# Altium schematic sheet Module 4G.SchDoc
size A3; SheetNumber: 4; SheetTotal: 8
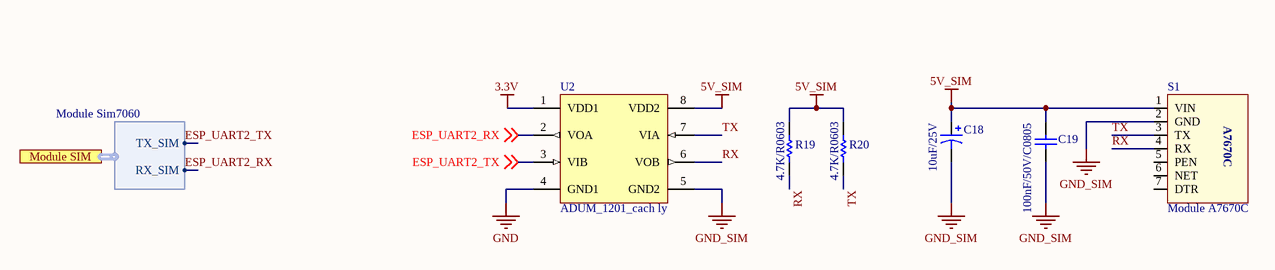
[diagram p0: Module 4G.SchDoc]

## Parts
C18  10uF/25V  [CAP TANT SIZE B]
C19  100nF/50V/C0805  [C0805]
R19  4.7K/R0603  [R0603]
R20  4.7K/R0603  [R0603]
S1  Module A7670C  [Module A7670C]
U2  ADUM_1201_cach ly  [ADUM1201]

## Ports
Module SIM (harness Module Sim7060)

## Harnesses
Module Sim7060: TX_SIM, RX_SIM

## Nets
3.3V: U2.1(VDD1)
5V_SIM: C18.1(+) C19.2 R19.2 R20.2 S1.1(VIN) U2.8(VDD2)
GND: U2.4(GND1)
GND_SIM: C18.2(-) C19.1 S1.2(GND) U2.5(GND2)
ESP_UART2_RX: U2.2(VOA) ; off-sheet ESP_UART2_RX, port Module SIM.RX_SIM
ESP_UART2_TX: U2.3(VIB) ; off-sheet ESP_UART2_TX, port Module SIM.TX_SIM
RX: R19.1 S1.4(RX) U2.6(VOB)
TX: R20.1 S1.3(TX) U2.7(VIA)

Not connected (* = marked no-connect by the designer): S1 5(PEN) 6(NET) 7(DTR)

## Notes on the sheet
- Title
- Size:
- Date:
- A3
- Number:
- Time:
- Revision:
- Sheet
- of
- NICHIETSUVN.COM <http://NICHIETSUVN.COM>
- R&D
- File:
- (in symbol Module A7670C) A7670C

## Library data of the parts
C18 = 10uF/25V/SIZE B/10%: CAP TANT 10UF 25V 10% 1411; Manufacturer: KEMET; Manufacturer Part Number: T491B106K025AT; Manufacturer Size Code: B; Capacitance: 10µF; Type: Molded; ESR (Equivalent Series Resistance): 3 Ohm; Lifetime @ Temp.: 2000 Hrs @ 85°C; Supplier 1: Digi-Key; RoHS: RoHS Compliant; Category: Capacitors; Stock 1: 74222; Pricing 1: 1=1.11, 10=0.842, 25=0.7448, 50=0.6994, 100=0.6022, 250=0.54392, 500=0.46622, 1000=0.40147 (USD); Packaging: Cut Tape (CT); Part Status: Active; Tolerance: ±10%; Voltage - Rated: 25V; Operating Temperature: -55°C ~ 125°C; Mounting Type: Surface Mount; Package / Case: 1411 (3528 Metric); Size / Dimension: 0.138" L x 0.110" W (3.50mm x 2.80mm); Height - Seated (Max): 0.083" (2.10mm); Lead Spacing: -; Features: General Purpose; Failure Rate: -; ComponentLink1URL: http://www.kemet.com/Lists/ProductCatalog/Attachments/254/KEM_T2005_T491.pdf; ComponentLink1Description: http://www.kemet.com/Lists/ProductCatalog/Attachments/254/KEM_T2005_T491.pdf; Supplier Part Number 1: 399-5125-1-ND
C19 = 0.1uF/50V/C0805/10%: CAP CER 0.1UF 50V 10% X7R 0805; Manufacturer: Samsung Electro-Mechanics America, Inc.; Manufacturer Part Number: CL21B104KBCNNNC; Capacitance: 0.1µF; RoHS: RoHS Compliant; Category: Capacitors; Packaging: Cut Tape (CT); Tolerance: ±10%; Voltage - Rated: 50V; Temperature Coefficient: X7R; Mounting Type: Surface Mount, MLCC; Operating Temperature: -55°C ~ 125°C; Applications: General Purpose; Ratings: -; Package / Case: 0805 (2012 Metric); Size / Dimension: 0.079" L x 0.049" W (2.00mm x 1.25mm); Height - Seated (Max): -; Thickness (Max): 0.037" (0.95mm); Lead Spacing: -; Features: -; Lead Style: -; ComponentLink1URL: http://www.samsungsem.com/kr/front/downloadcms.do?path=/kr/support/product-search/mlcc/__icsFiles/afieldfile/2015/04/16&fileName=CL21B104KBCNNNC.pdf; ComponentLink1Description: http://www.samsungsem.com/kr/front/downloadcms.do?path=/kr/support/product-search/mlcc/__icsFiles/afieldfile/2015/04/16&fileName=CL21B104KBCNNNC.pdf; Supplier 1: Digi-Key; Supplier Part Number 1: 1276-1003-1-ND
R19 R20 = 4.7K/R0603/1%: RES SMD 4.7K OHM 1% 1/10W 0603; Manufacturer: Yageo; Manufacturer Part Number: RC0603FR-074K7L; Power (Watts): 0.1W, 1/10W; Temperature Coefficient: ±100ppm/°C; Supplier 1: Digi-Key; RoHS: RoHS Compliant; Category: Resistors; Stock 1: 3295420; Pricing 1: 1=0.1, 10=0.014, 25=0.01, 100=0.0057, 250=0.00436, 500=0.00348, 1000=0.00257, 2500=0.00223 (USD); Packaging: Cut Tape (CT); Resistance (Ohms): 4.7k; Tolerance: ±1%; Composition: Thick Film; Features: Moisture Resistant; Operating Temperature: -55°C ~ 155°C; Package / Case: 0603 (1608 Metric); Supplier Device Package: 0603; Size / Dimension: 0.063" L x 0.031" W (1.60mm x 0.80mm); Height: 0.022" (0.55mm); Number of Terminations: 2; ComponentLink1URL: http://www.yageo.com/NewPortal/yageodocoutput?fileName=/pdf/R-Chip/PYu-RC_Group_51_RoHS_L_3.pdf; ComponentLink1Description: http://www.yageo.com/NewPortal/yageodocoutput?fileName=/pdf/R-Chip/PYu-RC_Group_51_RoHS_L_3.pdf; Supplier Part Number 1: 311-4.70KHRCT-ND; PN_LCSC: *; Link_LCSC: *; DNI: *
S1 = Module A7670C: ComponentLink1Description: Buy; ComponentLink1URL: https://linhkienthuduc.com/module-4g-simcom-a7670cas-da-ra-chan-thay-the-module-sim800l?fbclid=IwAR1G5wYYUv7p81VrcWdIp5blH95Ph3Cg0YzZirZTlKBqqVU0n-BOBnrUa-4